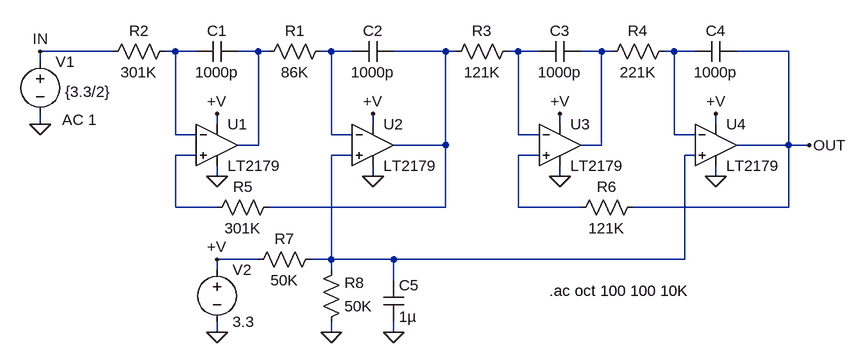
[diagram p0: schematic 2179.asc]
2179.asc, the LTspice schematic file:
Version 4
SHEET 1 1164 680
WIRE -16 96 -128 96
WIRE 80 96 64 96
WIRE 112 96 80 96
WIRE 208 96 176 96
WIRE 224 96 208 96
WIRE 320 96 304 96
WIRE 352 96 320 96
WIRE 496 96 416 96
WIRE 512 96 496 96
WIRE 608 96 592 96
WIRE 640 96 608 96
WIRE 736 96 704 96
WIRE 752 96 736 96
WIRE 848 96 832 96
WIRE 880 96 848 96
WIRE 1024 96 944 96
WIRE -128 112 -128 96
WIRE -128 208 -128 192
WIRE 144 208 144 192
WIRE 384 208 384 192
WIRE 672 208 672 192
WIRE 912 208 912 192
WIRE 80 224 80 96
WIRE 112 224 80 224
WIRE 320 224 320 96
WIRE 352 224 320 224
WIRE 608 224 608 96
WIRE 640 224 608 224
WIRE 848 224 848 96
WIRE 880 224 848 224
WIRE 208 240 208 96
WIRE 208 240 176 240
WIRE 496 240 496 96
WIRE 496 240 416 240
WIRE 736 240 736 96
WIRE 736 240 704 240
WIRE 1024 240 1024 96
WIRE 1024 240 944 240
WIRE 1056 240 1024 240
WIRE 112 256 80 256
WIRE 352 256 320 256
WIRE 640 256 608 256
WIRE 880 256 864 256
WIRE 144 288 144 272
WIRE 384 288 384 272
WIRE 672 288 672 272
WIRE 912 288 912 272
WIRE 80 336 80 256
WIRE 144 336 80 336
WIRE 496 336 496 240
WIRE 496 336 224 336
WIRE 608 336 608 256
WIRE 704 336 608 336
WIRE 1024 336 1024 240
WIRE 1024 336 784 336
WIRE 208 416 144 416
WIRE 320 416 320 256
WIRE 320 416 288 416
WIRE 416 416 320 416
WIRE 864 416 864 256
WIRE 864 416 416 416
WIRE 144 432 144 416
WIRE 320 432 320 416
WIRE 416 448 416 416
WIRE 144 528 144 512
WIRE 320 528 320 512
WIRE 416 528 416 512
FLAG -128 208 0
FLAG 144 192 +V
FLAG 144 416 +V
FLAG 144 288 0
FLAG 384 192 +V
FLAG 384 288 0
FLAG 672 192 +V
FLAG 672 288 0
FLAG 912 192 +V
FLAG 912 288 0
FLAG 320 528 0
FLAG 144 528 0
FLAG 416 528 0
FLAG 1056 240 OUT
FLAG -128 96 IN
SYMBOL voltage -128 96 R0
WINDOW 3 38 62 Left 2
WINDOW 123 34 105 Left 2
WINDOW 39 0 0 Left 2
SYMATTR Value {3.3/2}
SYMATTR Value2 AC 1
SYMATTR InstName V1
SYMBOL res 80 80 R90
WINDOW 0 0 56 VBottom 2
WINDOW 3 32 56 VTop 2
SYMATTR InstName R2
SYMATTR Value 301K
SYMBOL cap 176 80 R90
WINDOW 0 0 32 VBottom 2
WINDOW 3 32 32 VTop 2
SYMATTR InstName C1
SYMATTR Value 1000p
SYMBOL res 320 80 R90
WINDOW 0 0 56 VBottom 2
WINDOW 3 32 56 VTop 2
SYMATTR InstName R1
SYMATTR Value 86K
SYMBOL cap 416 80 R90
WINDOW 0 0 32 VBottom 2
WINDOW 3 32 32 VTop 2
SYMATTR InstName C2
SYMATTR Value 1000p
SYMBOL res 608 80 R90
WINDOW 0 0 56 VBottom 2
WINDOW 3 32 56 VTop 2
SYMATTR InstName R3
SYMATTR Value 121K
SYMBOL cap 704 80 R90
WINDOW 0 0 32 VBottom 2
WINDOW 3 32 32 VTop 2
SYMATTR InstName C3
SYMATTR Value 1000p
SYMBOL res 848 80 R90
WINDOW 0 0 56 VBottom 2
WINDOW 3 32 56 VTop 2
SYMATTR InstName R4
SYMATTR Value 221K
SYMBOL cap 944 80 R90
WINDOW 0 0 32 VBottom 2
WINDOW 3 32 32 VTop 2
SYMATTR InstName C4
SYMATTR Value 1000p
SYMBOL res 240 320 R90
WINDOW 0 0 56 VBottom 2
WINDOW 3 32 56 VTop 2
SYMATTR InstName R5
SYMATTR Value 301K
SYMBOL res 800 320 R90
WINDOW 0 0 56 VBottom 2
WINDOW 3 32 56 VTop 2
SYMATTR InstName R6
SYMATTR Value 121K
SYMBOL res 304 400 R90
WINDOW 0 0 56 VBottom 2
WINDOW 3 32 56 VTop 2
SYMATTR InstName R7
SYMATTR Value 50K
SYMBOL res 304 528 M180
WINDOW 0 36 76 Left 2
WINDOW 3 36 40 Left 2
SYMATTR InstName R8
SYMATTR Value 50K
SYMBOL voltage 144 416 R0
SYMATTR InstName V2
SYMATTR Value 3.3
SYMBOL cap 400 448 R0
SYMATTR InstName C5
SYMATTR Value 1µ
SYMBOL opamps\\LT2179 144 176 R0
SYMATTR InstName U1
SYMBOL opamps\\LT2179 384 176 R0
SYMATTR InstName U2
SYMBOL opamps\\LT2179 672 176 R0
SYMATTR InstName U3
SYMBOL opamps\\LT2179 912 176 R0
SYMATTR InstName U4
TEXT 656 464 Left 2 !.ac oct 100 100 10K

The netlist it stands for:
* 2179.asc
V1 IN 0 {3.3/2} AC 1
R2 N001 IN 301K
C1 N002 N001 1000p
R1 N003 N002 86K
C2 N004 N003 1000p
R3 N005 N004 121K
C3 N006 N005 1000p
R4 N007 N006 221K
C4 OUT N007 1000p
R5 N004 N008 301K
R6 OUT N010 121K
R7 N009 +V 50K
R8 0 N009 50K
V2 +V 0 3.3
C5 N009 0 1µ
XU1 N008 N001 +V 0 N002 LT2179  ; pins In+ In- V+ V- OUT
XU2 N009 N003 +V 0 N004 LT2179  ; pins In+ In- V+ V- OUT
XU3 N010 N005 +V 0 N006 LT2179  ; pins In+ In- V+ V- OUT
XU4 N009 N007 +V 0 OUT LT2179  ; pins In+ In- V+ V- OUT
.ac oct 100 100 10K
.backanno
.end